# EAGLE design indicate switch (EAGLE 7.4.0)
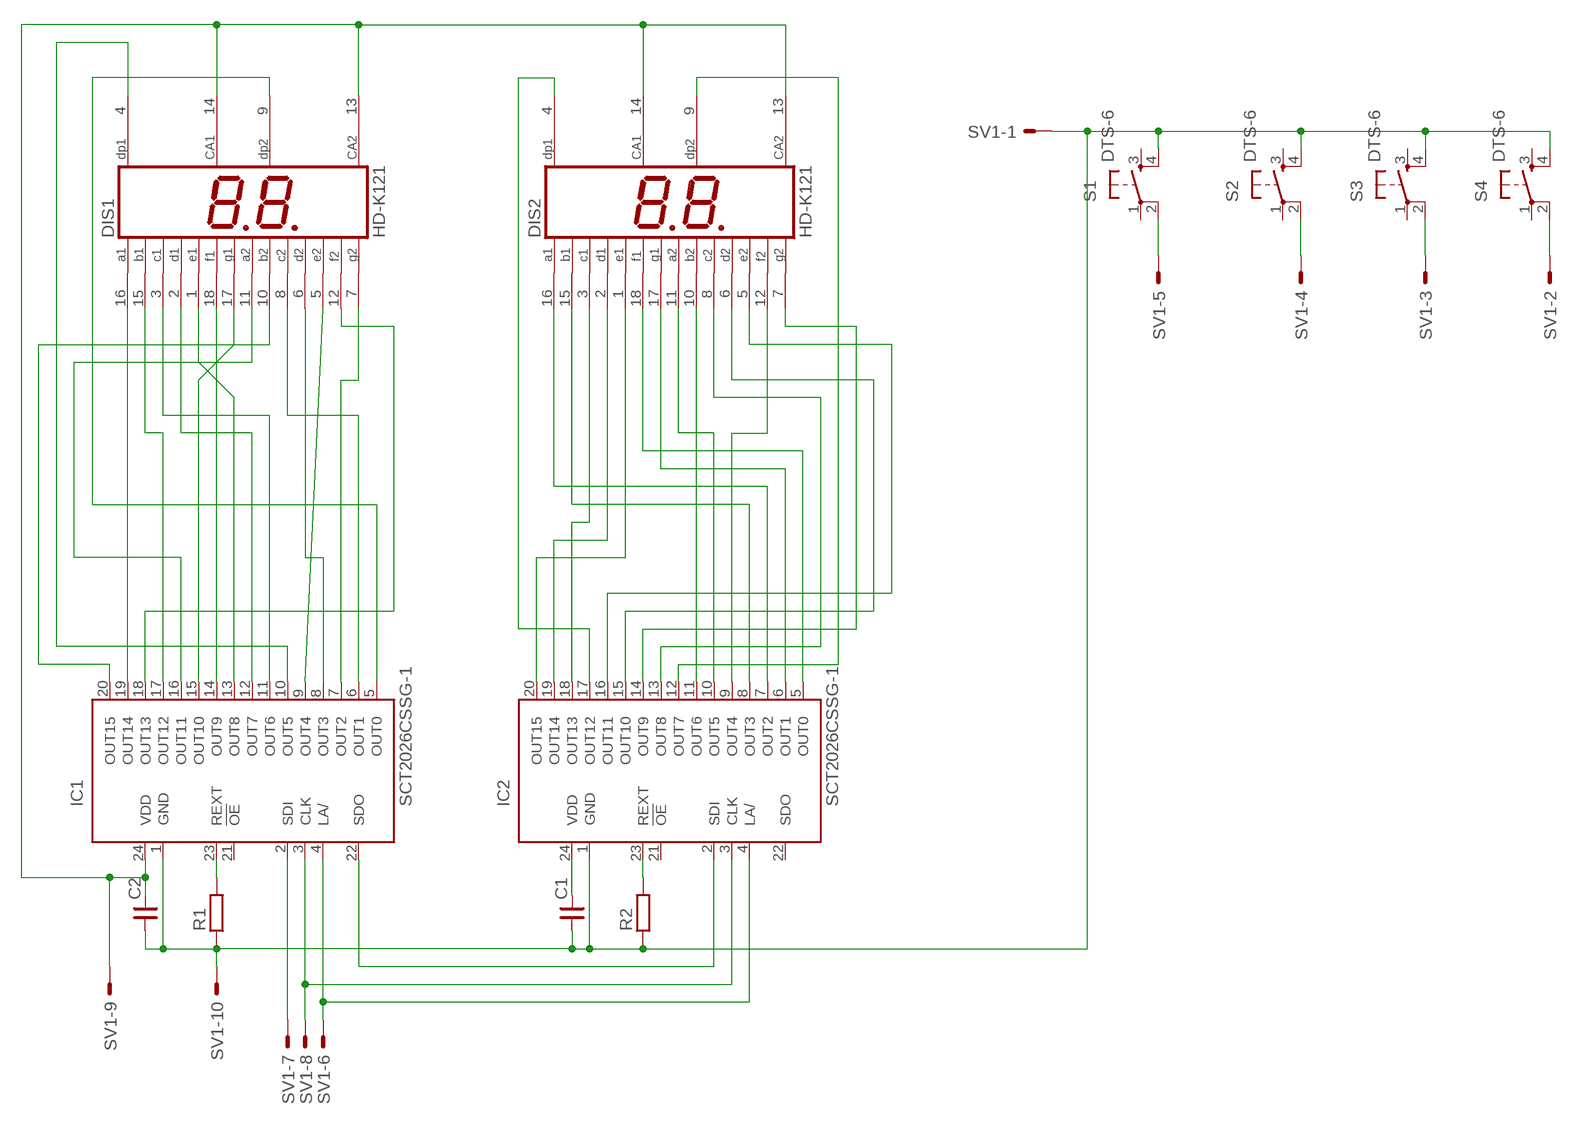
[diagram p0: schematic, sheet 1]

## Parts
C1  CNP-0805  [0805]
C2  CNP-0805  [0805]
DIS1  HD-K121  [HDSP-R]
DIS2  HD-K121  [HDSP-R]
IC1  SCT2026CSSG-1  [SSOP24]
IC2  SCT2026CSSG-1  [SSOP24]
R1  RESISTOR_0805  [RESC2012X70N]
R2  RESISTOR_0805  [RESC2012X70N]
S1  DTS-6  [DTS-6]
S2  DTS-6  [DTS-6]
S3  DTS-6  [DTS-6]
S4  DTS-6  [DTS-6]
SV1  ML10E  [ML10]

## Nets
N$1: S2.2 SV1.4
N$2: S1.2 SV1.5
N$3: S4.2 SV1.2
N$4: IC1.2(SDI) SV1.7
N$5: C1.1 C2.1 IC1.1(GND) IC2.1(GND) R1.1 R2.1 S1.4 S2.4 S3.4 S4.4 SV1.1 SV1.10
N$6: C2.2 DIS1.13(CA2) DIS1.14(CA1) DIS2.13(CA2) DIS2.14(CA1) IC1.24(VDD) SV1.9
N$8: C1.2 IC2.24(VDD)
N$9: DIS1.15(B1) IC1.17(OUT12)
N$10: IC1.23(REXT) R1.2
N$11: IC2.23(REXT) R2.2
N$12: S3.2 SV1.3
N$13: IC1.3(CLK) IC2.3(CLK) SV1.8
N$14: IC1.4(LA/) IC2.4(LA/) SV1.6
N$15: IC1.22(SDO) IC2.2(SDI)
N$16: DIS1.9(DP2) IC1.5(OUT0)
N$17: DIS1.8(C2) IC1.6(OUT1)
N$18: DIS1.7(G2) IC1.7(OUT2)
N$19: DIS1.6(D2) IC1.8(OUT3)
N$20: DIS1.5(E2) IC1.9(OUT4)
N$21: DIS1.4(DP1) IC1.10(OUT5)
N$22: DIS1.3(C1) IC1.11(OUT6)
N$23: DIS1.2(D1) IC1.12(OUT7)
N$24: DIS1.1(E1) IC1.13(OUT8)
N$25: DIS1.18(F1) IC1.14(OUT9)
N$26: DIS1.17(G1) IC1.15(OUT10)
N$27: DIS1.16(A1) IC1.16(OUT11)
N$28: DIS1.12(F2) IC1.18(OUT13)
N$29: DIS1.11(A2) IC1.19(OUT14)
N$30: DIS1.10(B2) IC1.20(OUT15)
N$32: DIS2.18(F1) IC2.5(OUT0)
N$33: DIS2.17(G1) IC2.6(OUT1)
N$34: DIS2.16(A1) IC2.7(OUT2)
N$35: DIS2.15(B1) IC2.8(OUT3)
N$36: DIS2.12(F2) IC2.9(OUT4)
N$37: DIS2.11(A2) IC2.10(OUT5)
N$38: DIS2.10(B2) IC2.11(OUT6)
N$39: DIS2.9(DP2) IC2.12(OUT7)
N$40: DIS2.8(C2) IC2.13(OUT8)
N$41: DIS2.7(G2) IC2.14(OUT9)
N$42: DIS2.6(D2) IC2.15(OUT10)
N$43: DIS2.5(E2) IC2.16(OUT11)
N$44: DIS2.4(DP1) IC2.17(OUT12)
N$45: DIS2.3(C1) IC2.18(OUT13)
N$46: DIS2.2(D1) IC2.19(OUT14)
N$47: DIS2.1(E1) IC2.20(OUT15)
Unconnected: IC1.21(!OE) IC2.21(!OE) IC2.22(SDO) S1.1 S1.3 S2.1 S2.3 S3.1 S3.3 S4.1 S4.3

## Library data of the parts
C1 C2 = cap-master:CNP-: NON-POLARIZED CAP
DIS1 DIS2 = display-hp:HD-K121: LED DISPLAY 2 x 1 character 7 segment, decimal points right
IC1 IC2 = SCT2026:SCT2026: StarChip Technology 16-bit Serial-In-Out Constant-Current LED Driver. Source: www.starchips.com.tw/pdf/datasheet/SCT2026V03_01.pdf
R1 R2 = ipc-7351-resistor:RESISTOR_
S1-S4 = switch-tact:DTS-6
SV1 = con-harting-ml:ML10?E: HARTING

## Board
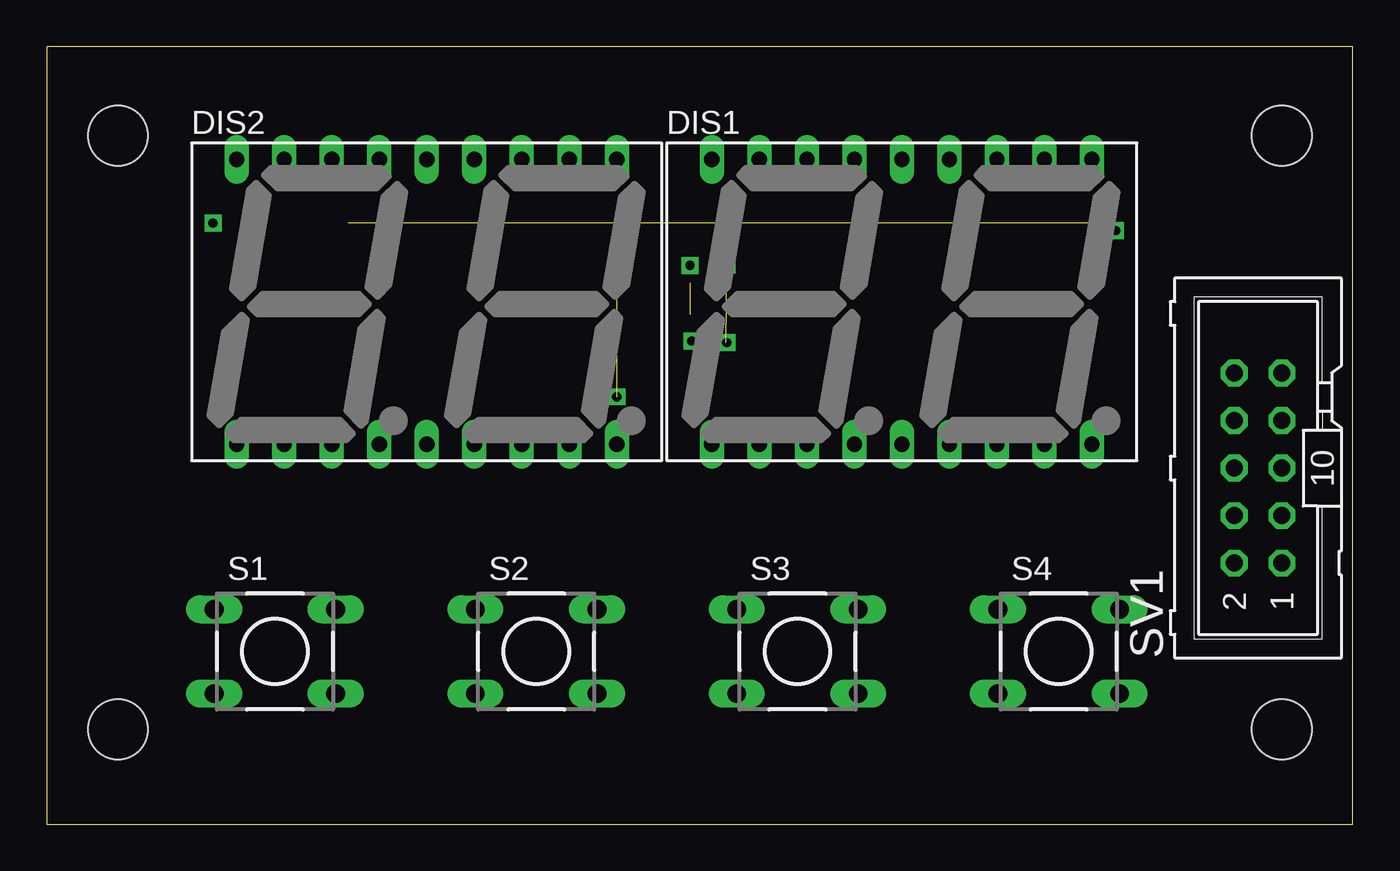
[diagram p1: board, top side]
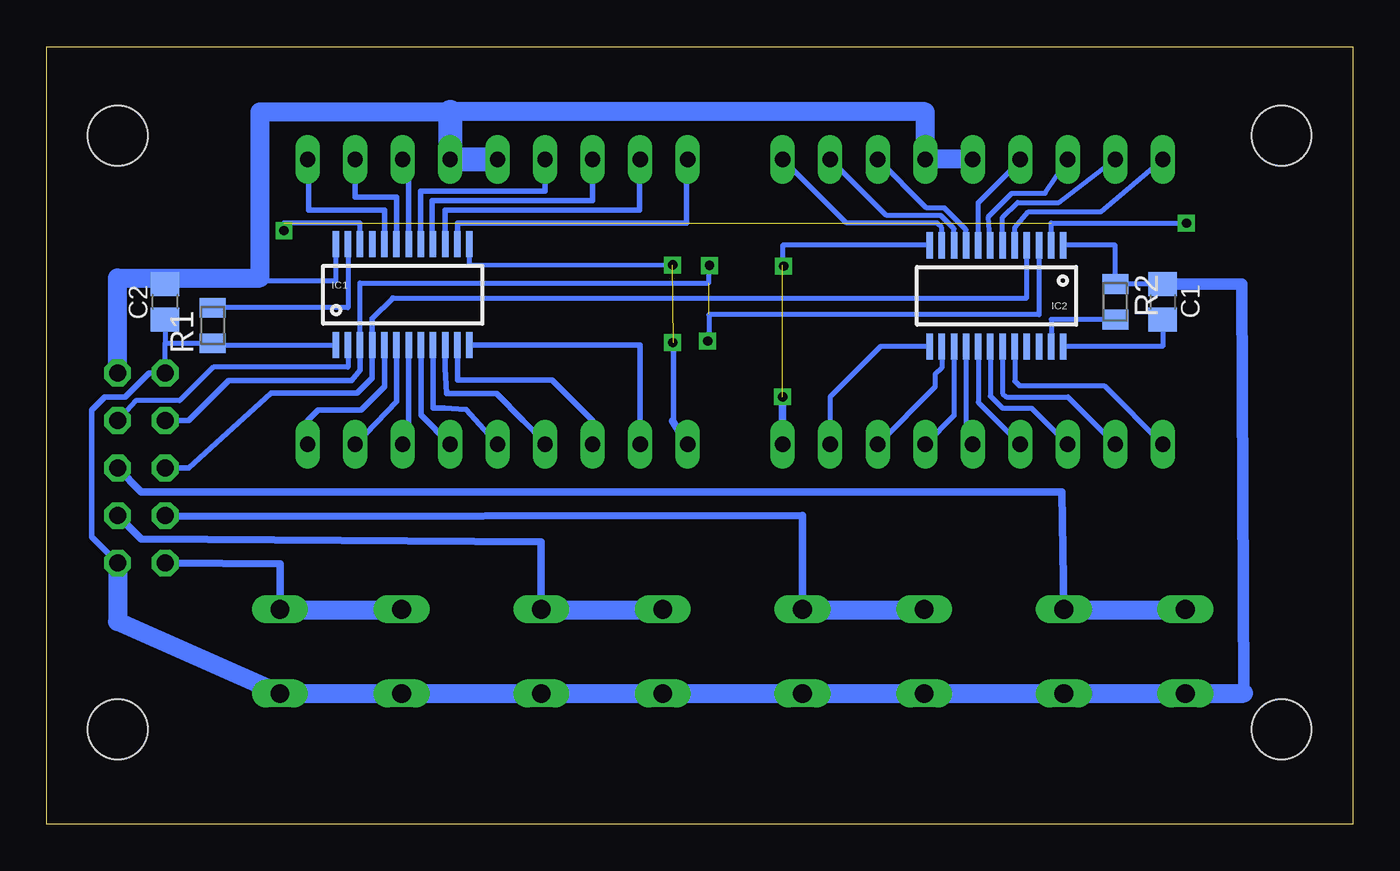
[diagram p2: board, bottom side, seen from below]

Size 69.83 x 41.58 mm. Coordinates in mm from the lower left corner, seen from the top.
Outline: 0,0 69.83,0 69.83,41.58 0,41.58 0,0
Copper layers (1*16): Top 0.035mm / dielectric 1.5mm / Bottom 0.035mm
Design rules "default": minimum track width 10mil, minimum drill 24mil, track to track 8mil, track to pad 8mil, pad to pad 8mil, via to via 8mil, smd to smd 8mil, copper to edge 40mil, drill to drill 8mil, minimum pad ring 10mil, minimum via ring 8mil, stop-mask expansion 4mil, vias tented up to drill 0mil, thermal gap 10mil
Holes 3.2 mm at 3.81,36.83 66.04,36.83 66.04,5.08 3.81,5.08

### Footprints (pad centres in the part's own frame; a part is rotated, then mirrored left to right if it is on the bottom)
0805 = smd 1.27 x 1.524: 1 -0.953,0; 2 0.953,0
HDSP-R = drill 0.813 long: 1 -10.16,-7.62; 2 -7.62,-7.62; 3 -5.08,-7.62; 4 -2.54,-7.62; 5 0,-7.62; 6 2.54,-7.62; 7 5.08,-7.62; 8 7.62,-7.62; 9 10.16,-7.62; 10 10.16,7.62; 11 7.62,7.62; 12 5.08,7.62; 13 2.54,7.62; 14 0,7.62; 15 -2.54,7.62; 16 -5.08,7.62; 17 -7.62,7.62; 18 -10.16,7.62
SSOP24 = smd 0.348 x 1.397: 1 -3.575,-3.021; 2 -2.925,-3.021; 3 -2.275,-3.021; 4 -1.625,-3.021; 5 -0.975,-3.021; 6 -0.325,-3.021; 7 0.325,-3.021; 8 0.975,-3.021; 9 1.625,-3.021; 10 2.275,-3.021; 11 2.925,-3.021; 12 3.575,-3.021; 13 3.575,2.386; 14 2.925,2.386; 15 2.275,2.386; 16 1.625,2.386; 17 0.975,2.386; 18 0.325,2.386; 19 -0.325,2.386; 20 -0.975,2.386; 21 -1.625,2.386; 22 -2.275,2.386; 23 -2.925,2.386; 24 -3.575,2.386
RESC2012X70N = smd 1.05 x 1.4: 1 -0.95,0; 2 0.95,0
DTS-6 = drill 1 long: 1 -3.25,2.25; 2 3.25,2.25; 3 -3.25,-2.25; 4 3.25,-2.25
ML10 = drill 0.914 octagon: 1 -5.08,-1.27; 2 -5.08,1.27; 3 -2.54,-1.27; 4 -2.54,1.27; 5 0,-1.27; 6 0,1.27; 7 2.54,-1.27; 8 2.54,1.27; 9 5.08,-1.27; 10 5.08,1.27

### Placement (x,y rotation side)
C1  10.16,27.94 270 bottom
C2  63.5,27.94 90 bottom
DIS1  45.72,27.94 0 top
DIS2  20.32,27.94 0 top
IC1  50.8,28.64 0 bottom
IC2  19.05,27.94 180 bottom
R1  60.96,26.67 90 bottom
R2  12.7,27.94 270 bottom
S1  12.2,9.24 0 top
S2  26.17,9.24 0 top
S3  40.14,9.24 0 top
S4  54.11,9.24 0 top
SV1  64.77,19.05 90 top

### Tracks (layer width: path | path; a pad name or v marks a point on that pad's centre or on a via)
N$1
  Bottom 0.406: S2.2 29.42,13.9 29.43,16.51 63.44,16.45 SV1.4
N$2
  Bottom 0.406: S1.2 15.55,17.78 64.77,17.78 SV1.5
N$3
  Bottom 0.406: S4.2 57.36,13.93 SV1.2
N$4
  Bottom 0.254: IC1.2 53.73,24.45 60.93,24.45 62.73,22.65 65.08,22.65 SV1.7
N$5
  Bottom 0.254: SV1.10 63.5,25.72 | C2.1 63.5,25.72 | 63.5,25.72 R1.1 60.96,25.62 IC1.1 | S1.4 15.45,7.01 | C1.1 R2.1 12.7,30.96 IC2.1 | S4.4 57.36,6.7 57.92,6.7 57.92,6.99 S4.4
  Bottom 0.305: SV1.10 64.35,24.13 65.63,22.85 66.73,22.85 67.43,22.15 67.43,15.36 SV1.1
  Bottom 0.61: 5.83,7.01 5.93,28.89 C1.1
  Bottom 1.016: SV1.1 66.04,10.84 S4.4 S3.4 S2.4 S1.4 | 15.45,7.01 5.83,7.01
N$6
  Bottom 0.254: IC1.24 54.38,29.06 58.42,29.06
  Bottom 0.305: 58.42,29.06 58.42,29.21 C2.2
  Bottom 1.016: DIS2.14 DIS2.13 22.86,38.1 48.26,38.1 58.42,38.1 58.42,29.21 66.04,29.21 SV1.9
  Bottom 1.27: DIS1.14 DIS1.13 48.26,38.1
N$7
  Bottom 1.016: 8.89,11.43 15.24,11.43
N$8
  Bottom 0.254: C1.2 10.16,25.55 IC2.24
N$9
  Bottom 0.305: DIS1.15 43.18,33.85 49.83,33.85 IC1.17
N$10
  Bottom 0.254: IC1.23 53.73,27.62 R1.2
N$11
  Bottom 0.254: R2.2 16.12,26.99 IC2.23
N$12
  Bottom 0.406: S3.2 43.39,15.11 64.78,15.25 SV1.3
N$13  (1 unrouted)
  Bottom 0.254: IC1.3 53.08,28.95 34.43,28.95 34.43,29.85 | IC2.3 16.77,27.25 34.43,27.25 34.43,25.75
  Bottom 0.305: IC1.3 53.08,24.3 53.54,23.73 60.09,23.73 62.23,21.59 SV1.8
N$14
  Bottom 0.254: 51.3,28.15 17.43,28.15 IC2.4
  Bottom 0.305: SV1.6 62.23,19.05 57.83,23.05 53.23,23.05 52.42,23.86 IC1.4 52.43,27.05 51.3,28.15 51.33,28.15
N$15  (1 unrouted)
  Bottom 0.254: IC2.2 16.12,32.15 8.93,32.15 | IC1.22 53.08,32.15 57.15,32.15
N$16
  Bottom 0.305: IC1.5 51.77,23.41 53.03,22.15 55.32,22.15 55.88,21.59 DIS1.9
N$17
  Bottom 0.305: IC1.6 51.12,22.61 53.34,20.29 DIS1.8
N$18
  Bottom 0.305: IC1.7 50.48,20.64 DIS1.7
N$19
  Bottom 0.305: IC1.8 49.83,21.89 DIS1.6
N$20
  Bottom 0.305: DIS1.5 47.42,22.19 48.59,22.26 49.16,22.26 49.17,23.77 IC1.9
N$21
  Bottom 0.305: IC1.10 48.52,24.39 48.46,23.03 45.79,23.03 44.35,21.59 43.18,20.39 DIS1.4
N$22
  Bottom 0.305: IC1.11 47.88,23.75 42.8,23.75 40.64,21.59 DIS1.3
N$23
  Bottom 0.305: IC1.12 38.1,25.62 DIS1.2
N$24  (1 unrouted)
  Bottom 0.254: IC1.13 47.26,29.93 36.36,29.91
  Bottom 0.305: 36.36,21.56 36.33,21.56 36.33,25.75
  Bottom 0.406: DIS1.1 36.36,21.56
N$25
  Bottom 0.305: IC1.14 47.88,32.15 35.63,32.15 35.63,35.56 DIS1.18
N$26
  Bottom 0.305: IC1.15 48.52,32.85 38.13,32.85 38.13,35.56 DIS1.17
N$27
  Bottom 0.305: DIS1.16 40.64,33.35 49.23,33.35 49.23,31.03 IC1.16
N$28
  Bottom 0.305: IC1.18 50.48,35.56 DIS1.12
N$29
  Bottom 0.305: IC1.19 51.12,33.55 53.33,33.55 DIS1.11
N$30
  Bottom 0.305: IC1.20 51.77,32.85 55.83,32.85 55.83,35.56 DIS1.10
N$31  (via drill 0.5 pad 0.25)
  other vias: 36.36,29.91
N$32
  Bottom 0.254: IC2.5 18.07,31.91 17.33,32.75 13.47,32.75 DIS2.18
N$33
  Bottom 0.254: IC2.6 18.73,32.45 17.93,33.25 15.71,33.25 DIS2.17
N$34
  Bottom 0.254: IC2.7 19.48,32.51 18.23,33.75 16.45,33.75 DIS2.16
N$35
  Bottom 0.254: IC2.8 20.02,33.26 17.73,35.55 17.73,35.51 DIS2.15
N$36
  Bottom 0.254: IC2.9 20.68,31.8 21.83,32.95 22.79,32.95 DIS2.12
N$37
  Bottom 0.254: IC2.10 21.32,31.84 22.03,32.55 24.93,32.55 DIS2.11
N$38
  Bottom 0.254: IC2.11 21.98,31.89 22.23,32.15 27.07,32.15 DIS2.10
N$39  (1 unrouted)
  Bottom 0.254: IC2.12 30.48,30.96 30.48,29.91
  Bottom 0.406: DIS2.9 30.48,22.86
N$40
  Bottom 0.254: IC2.13 25.25,25.55 27.94,22.86 DIS2.8
N$41
  Bottom 0.254: IC2.14 21.98,24.41 22.33,24.05 22.33,23.39 DIS2.7
N$42
  Bottom 0.254: IC2.15 21.32,21.86 DIS2.6
N$43
  Bottom 0.254: IC2.16 20.68,20.68 DIS2.5
N$44
  Bottom 0.254: IC2.17 20.02,22.57 DIS2.4
N$45
  Bottom 0.254: IC2.18 19.38,22.89 18.73,22.25 17.17,22.25 DIS2.3
N$46
  Bottom 0.254: IC2.19 18.73,23.05 18.53,22.85 15.23,22.85 DIS2.2
N$47
  Bottom 0.254: IC2.20 18.07,23.7 17.83,23.45 13.29,23.45 DIS2.1
N$48  (via drill 0.5 pad 0.25)
  other vias: 30.43,29.85
N$49  (via drill 0.5 pad 0.25)
  other vias: 36.36,25.76
N$51  (via drill 0.5 pad 0.25)
  other vias: 57.15,31.75
N$52  (via drill 0.5 pad 0.25)
  other vias: 8.89,32.15
N$53  (via drill 0.5 pad 0.25)
  other vias: 30.48,22.86
N$54  (via drill 0.5 pad 0.25)
  other vias: 34.49,25.84
N$55  (via drill 0.5 pad 0.25)
  other vias: 34.39,29.88
N$56
  Bottom 1.016: 22.86,11.43 29.21,11.43
N$57
  Bottom 1.016: 36.83,11.43 43.18,11.43
N$58
  Bottom 1.016: 50.8,11.43 57.15,11.43